# EAGLE schematic edition 3-1 (EAGLE 9.6.2)
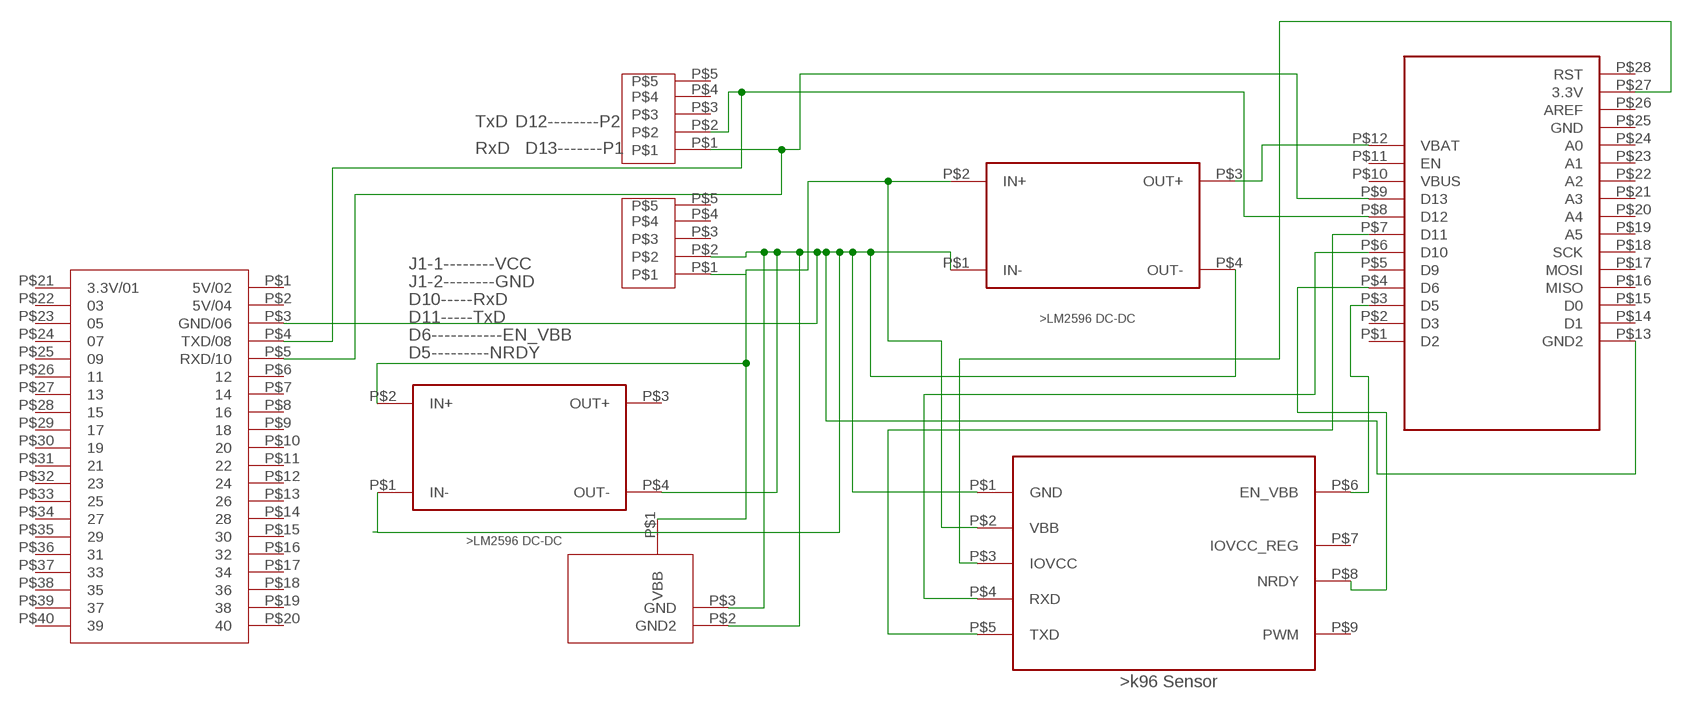
[diagram p0: schematic, sheet 1]

## Parts
DCDC1  DCDC  [DCDC]
DCDC2  DCDC  [DCDC]
FEATHER1  FEATHER  [FEATHER]
K96SENSOR1  K96SENSOR  [K96SENSOR]
PIN1  PIN  [PIN]
PIN2  PIN  [PIN]
U$1  POWER  [POWERIN]
U$2  RASPBERRYPI  [RASPBERRYPI]

## Nets
N$1: DCDC1.P$2(IN+) DCDC2.P$2(IN+) K96SENSOR1.P$2(VBB) PIN1.P$1 U$1.P$1(VBB)
N$2: DCDC1.P$1(IN-) DCDC1.P$4(OUT-) DCDC2.P$1(IN-) DCDC2.P$4(OUT-) FEATHER1.P$13(GND2) K96SENSOR1.P$1(GND) PIN1.P$2 U$1.P$2(GND2) U$1.P$3(GND) U$2.P$3(GND/06)
N$3: FEATHER1.P$6(D10) K96SENSOR1.P$4(RXD)
N$4: DCDC1.P$3(OUT+) FEATHER1.P$12(VBAT)
N$5: FEATHER1.P$7(D11) K96SENSOR1.P$5(TXD)
N$6: FEATHER1.P$4(D6) K96SENSOR1.P$8(NRDY)
N$7: FEATHER1.P$9(D13) PIN2.P$1 U$2.P$5(RXD/10)
N$8: FEATHER1.P$3(D5) K96SENSOR1.P$6(EN_VBB)
N$9: FEATHER1.P$27(3.3V) K96SENSOR1.P$3(IOVCC)
N$10: FEATHER1.P$8(D12) PIN2.P$2 U$2.P$4(TXD/08)
Unconnected: DCDC2.P$3(OUT+) FEATHER1.P$1(D2) FEATHER1.P$2(D3) FEATHER1.P$5(D9) FEATHER1.P$10(VBUS) FEATHER1.P$11(EN) FEATHER1.P$14(D1) FEATHER1.P$15(D0) FEATHER1.P$16(MISO) FEATHER1.P$17(MOSI) FEATHER1.P$18(SCK) FEATHER1.P$19(A5) FEATHER1.P$20(A4) FEATHER1.P$21(A3) FEATHER1.P$22(A2) FEATHER1.P$23(A1) FEATHER1.P$24(A0) FEATHER1.P$25(GND) FEATHER1.P$26(AREF) FEATHER1.P$28(RST) K96SENSOR1.P$7(IOVCC_REG) K96SENSOR1.P$9(PWM) PIN1.P$3 PIN1.P$4 PIN1.P$5 PIN2.P$3 PIN2.P$4 PIN2.P$5 U$2.P$1(5V/02) U$2.P$2(5V/04) U$2.P$6 U$2.P$7 U$2.P$8 U$2.P$9 U$2.P$10 U$2.P$11 U$2.P$12 U$2.P$13 U$2.P$14 U$2.P$15 U$2.P$16 U$2.P$17 U$2.P$18 U$2.P$19 U$2.P$20 U$2.P$21(3.3V/01) U$2.P$22 U$2.P$23 U$2.P$24 U$2.P$25 U$2.P$26 U$2.P$27 U$2.P$28 U$2.P$29 U$2.P$30 U$2.P$31 U$2.P$32 U$2.P$33 U$2.P$34 U$2.P$35 U$2.P$36 U$2.P$37 U$2.P$38 U$2.P$39 U$2.P$40

## Notes on the sheet
- TxD | D12--------P2
- RxD   D13-------P1
- J1-1--------VCC
- J1-2--------GND
- D10-----RxD
- D11-----TxD
- D6-----------EN_VBB
- D5---------NRDY

## Library data of the parts
DCDC1 DCDC2 = untitled:DCDC
FEATHER1 = untitled:FEATHER
K96SENSOR1 = untitled:K96SENSOR
PIN1 PIN2 = untitled:PIN
U$1 = untitled:POWER
U$2 = untitled:RASPBERRYPI